# Altium schematic sheet MCU_Control.SchDoc
size A4; SheetNumber: 5; SheetTotal: 5
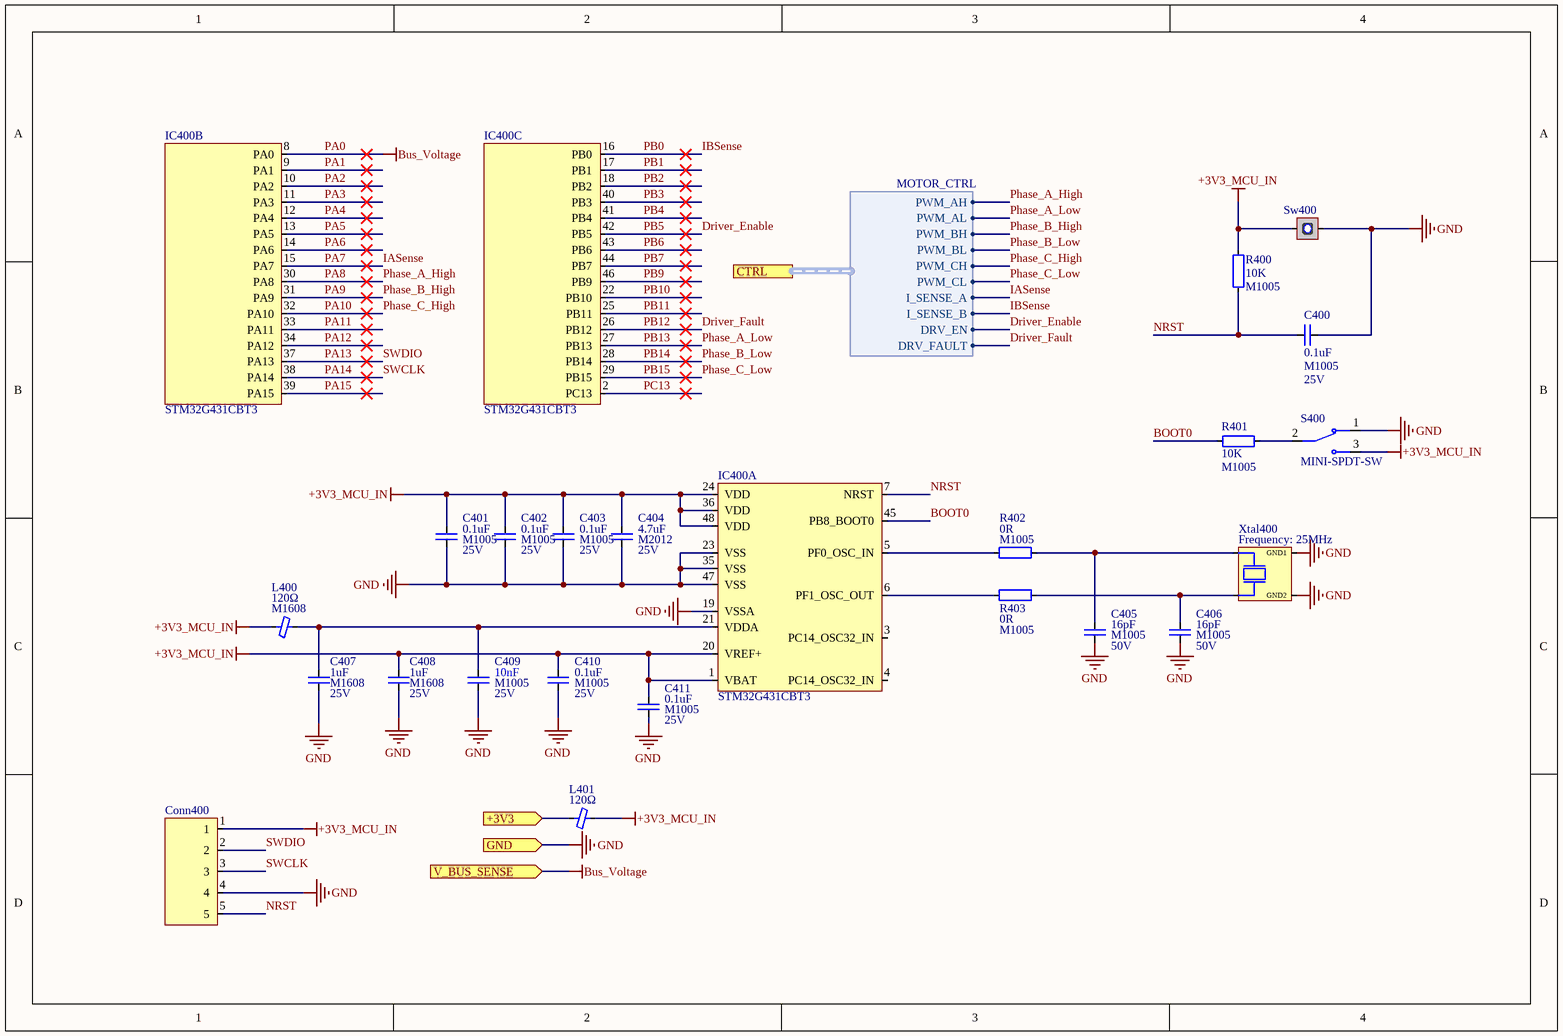
[diagram p0: MCU_Control.SchDoc]

## Parts
C400  value 0.1uF  Package: M1005  Rated Voltage: 25V  [Capacitor_Seramic_M1005_I0402]  (hidden comment: Capacitor_Seramic)
C401  value 0.1uF  Package: M1005  Rated Voltage: 25V  [Capacitor_Seramic_M1005_I0402]  (hidden comment: Capacitor_Seramic)
C402  value 0.1uF  Package: M1005  Rated Voltage: 25V  [Capacitor_Seramic_M1005_I0402]  (hidden comment: Capacitor_Seramic)
C403  value 0.1uF  Package: M1005  Rated Voltage: 25V  [Capacitor_Seramic_M1005_I0402]  (hidden comment: Capacitor_Seramic)
C404  value 4.7uF  Package: M2012  Rated Voltage: 25V  [Capacitor_Seramic_M2012_I0805]  (hidden comment: Capacitor_Seramic)
C405  value 16pF  Package: M1005  Rated Voltage: 50V  [Capacitor_Seramic_M1005_I0402]  (hidden comment: Capacitor_Seramic)
C406  value 16pF  Package: M1005  Rated Voltage: 50V  [Capacitor_Seramic_M1005_I0402]  (hidden comment: Capacitor_Seramic)
C407  value 1uF  Package: M1608  Rated Voltage: 25V  [Capacitor_Seramic_M1608_I0603]  (hidden comment: Capacitor_Seramic)
C408  value 1uF  Package: M1608  Rated Voltage: 25V  [Capacitor_Seramic_M1608_I0603]  (hidden comment: Capacitor_Seramic)
C409  value 10nF  Package: M1005  Rated Voltage: 25V  [Capacitor_Seramic_M1005_I0402]  (hidden comment: Capacitor_Seramic)
C410  value 0.1uF  Package: M1005  Rated Voltage: 25V  [Capacitor_Seramic_M1005_I0402]  (hidden comment: Capacitor_Seramic)
C411  value 0.1uF  Package: M1005  Rated Voltage: 25V  [Capacitor_Seramic_M1005_I0402]  (hidden comment: Capacitor_Seramic)
Conn400  SM05B-GHS-TB(LF)(SN)  [Connector - JST, SM05B-GHS-TB]  (value not drawn)
IC400  STM32G431CBT3  [QFP-48, 9mm x 9mm x 1.6mm]  (parts A,B,C of 3)
L400  value 120Ω  Package: M1608  [Ferrite_Bead_Smd_M1608_I0603]  (hidden comment: Ferrite Bead)
L401  value 120Ω  [Ferrite_Bead_Smd_M1608_I0603]  (hidden comment: Ferrite Bead)
R400  value 10K  Package: M1005  [Resistor_SMD_M1005_I0402]  (hidden comment: Resistor)
R401  value 10K  Package: M1005  [Resistor_SMD_M1005_I0402]  (hidden comment: Resistor)
R402  value 0R  Package: M1005  [Resistor_SMD_M1005_I0402]  (hidden comment: Resistor)
R403  value 0R  Package: M1005  [Resistor_SMD_M1005_I0402]  (hidden comment: Resistor)
S400  MINI-SPDT-SW  [MINI-SPDT-SW]
Sw400  Tactile, SPST  [Tactile, SPST - Panasonic, EVQQ2]  (value not drawn)
Xtal400  Frequency: 25MHz  [Kyocera, CX3225SB]  (hidden comment: Crystal, Two Gnd Pins)

## Ports
+3V3 (in), CTRL (harness MOTOR_CTRL), GND (in), V_BUS_SENSE (in)

## Harnesses
MOTOR_CTRL: PWM_AH, PWM_AL, PWM_BH, PWM_BL, PWM_CH, PWM_CL, I_SENSE_A, I_SENSE_B, DRV_EN, DRV_FAULT

## Nets
+3V3_MCU_IN: C401.1 C402.1 C403.1 C404.1 C408.1 C410.1 C411.1 Conn400.1 IC400.1(VBAT) IC400.20(VREF+) IC400.24(VDD) IC400.36(VDD) IC400.48(VDD) L400.1 L401.2 R400.1 S400.3 Sw400.B
GND: C400.1 C401.2 C402.2 C403.2 C404.2 C405.2 C406.2 C407.2 C408.2 C409.2 C410.2 C411.2 Conn400.4 IC400.19(VSSA) IC400.23(VSS) IC400.35(VSS) IC400.47(VSS) S400.1 Sw400.A Xtal400.GND1 Xtal400.GND2 ; port GND
PA0: IC400.8(PA0) ; port V_BUS_SENSE  [also labelled Bus_Voltage]
+3V3: L401.1 ; port +3V3
BOOT0: IC400.45(PB8_BOOT0) R401.2
Driver_Enable: IC400.42(PB5) ; port CTRL.DRV_EN  [also labelled PB5]
Driver_Fault: IC400.26(PB12) ; port CTRL.DRV_FAULT  [also labelled PB12]
IASense: IC400.15(PA7) ; port CTRL.I_SENSE_A  [also labelled PA7]
IBSense: IC400.16(PB0) ; port CTRL.I_SENSE_B  [also labelled PB0]
NRST: C400.2 Conn400.5 IC400.7(NRST) R400.2
PA1: IC400.9(PA1)
PA2: IC400.10(PA2)
PA3: IC400.11(PA3)
PA4: IC400.12(PA4)
PA5: IC400.13(PA5)
PA6: IC400.14(PA6)
PA8: IC400.30(PA8) ; port CTRL.PWM_AH  [also labelled Phase_A_High]
PA9: IC400.31(PA9) ; port CTRL.PWM_BH  [also labelled Phase_B_High]
PA10: IC400.32(PA10) ; port CTRL.PWM_CH  [also labelled Phase_C_High]
PA11: IC400.33(PA11)
PA12: IC400.34(PA12)
PA13: Conn400.2 IC400.37(PA13)  [also labelled SWDIO]
PA14: Conn400.3 IC400.38(PA14)  [also labelled SWCLK]
PA15: IC400.39(PA15)
PB1: IC400.17(PB1)
PB2: IC400.18(PB2)
PB3: IC400.40(PB3)
PB4: IC400.41(PB4)
PB6: IC400.43(PB6)
PB7: IC400.44(PB7)
PB9: IC400.46(PB9)
PB10: IC400.22(PB10)
PB11: IC400.25(PB11)
PB13: IC400.27(PB13) ; port CTRL.PWM_AL  [also labelled Phase_A_Low]
PB14: IC400.28(PB14) ; port CTRL.PWM_BL  [also labelled Phase_B_Low]
PB15: IC400.29(PB15) ; port CTRL.PWM_CL  [also labelled Phase_C_Low]
PC13: IC400.2(PC13)
NetC405_1: C405.1 R402.2 Xtal400.2
NetC406_1: C406.1 R403.2 Xtal400.1
NetC407_1: C407.1 C409.1 IC400.21(VDDA) L400.2
NetIC400_5: IC400.5(PF0_OSC_IN) R402.1
NetIC400_6: IC400.6(PF1_OSC_OUT) R403.1
NetR401_1: R401.1 S400.2

Not connected (* = marked no-connect by the designer): IC400 3(PC14_OSC32_IN) 4(PC14_OSC32_IN)

## Library data of the parts
C400-C403 C410 C411 = Capacitor_Seramic: Cap, Cer, 0.1uF, 25V, M1005; Manufacturer Part Number: CC0402KRX7R8BB104; Manufacturer: YAGEO; Tolerance: ±10%; Temperature Coefficient: X7R; ComponentLink1Description: Datasheet; ComponentLink1URL: *; ComponentLink2Description: Supplier Link; ComponentLink2URL: https://www.digikey.com/en/products/detail/yageo/CC0402KRX7R8BB104/5698946; Supplier Part Number: 311-2077-1-ND; Supplier Link: https://www.digikey.com/en/products/detail/yageo/CC0402KRX7R8BB104/5698946; Supplier Currency: $; Supplier: Digikey; Quantity, Min: 1; Quantity, Max: 1,000; Price, Min: $0.10000; Price, Max: $0.00700; Operating Temperature, Min: -55℃; Operating Temperature, Max: +125℃; Component Type: Ceramic; Component Category: Capacitor
C404 = Capacitor_Seramic: Cap, Cer, 4.7uF, 25V, M2012; Manufacturer Part Number: C2012X7R1E475K125AB; Manufacturer: TDK Corporation; Tolerance: ±10%; Temperature Coefficient: X7R; ComponentLink1Description: Datasheet; ComponentLink1URL: *; ComponentLink2Description: Supplier Link; ComponentLink2URL: https://www.digikey.com/en/products/detail/tdk-corporation/C2012X7R1E475K125AB/2443450; Supplier Part Number: 445-5972-1-ND; Supplier Link: https://www.digikey.com/en/products/detail/tdk-corporation/C2012X7R1E475K125AB/2443450; Supplier Currency: $; Supplier: Digikey; Quantity, Min: 1; Quantity, Max: 1,000; Price, Min: $0.08389; Price, Max: $0.31000; Operating Temperature, Min: -55℃; Operating Temperature, Max: +125℃; Component Type: Ceramic; Component Category: Capacitor
C405 C406 = Capacitor_Seramic: Cap, Cer, 16pF, 50V, M1005; Manufacturer Part Number: 0402N160J500CT; Manufacturer: Walsin; Tolerance: 5%; Temperature Coefficient: C0G, NP0; ComponentLink1Description: Datasheet; ComponentLink1URL: C:\Users\Public\Documents\Altium\env\Datasheets\Capacitor\Walsin - Multilayer Ceramic Capacitors.pdf; ComponentLink2Description: Supplier Link; ComponentLink2URL: https://www.digikey.com/en/products/detail/walsin-technology-corporation/0402N160J500CT/9354759; Supplier Part Number: 1292-1262-1-ND; Supplier Link: https://www.digikey.com/en/products/detail/walsin-technology-corporation/0402N160J500CT/9354759; Supplier Currency: $; Supplier: Digikey; Quantity, Min: 1; Quantity, Max: 250,000; Price, Min: $0.10000; Price, Max: $0.00182; Operating Temperature, Min: -55℃; Operating Temperature, Max: +125℃; Component Type: Ceramic; Component Category: Capacitor
C407 C408 = Capacitor_Seramic: Cap, Cer, 1uF, 25V, M1608; Manufacturer Part Number: C1608X7R1E105K080AB; Manufacturer: TDK Corporation; Tolerance: ±10%; Temperature Coefficient: X7R; ComponentLink1Description: Datasheet; ComponentLink1URL: *; ComponentLink2Description: Supplier Link; ComponentLink2URL: https://www.digikey.com/en/products/detail/tdk-corporation/C1608X7R1E105K080AB/2443434; Supplier Part Number: 445-5956-1-ND; Supplier Link: https://www.digikey.com/en/products/detail/tdk-corporation/C1608X7R1E105K080AB/2443434; Supplier Currency: $; Supplier: Digikey; Quantity, Min: 1; Quantity, Max: 1,000; Price, Min: $0.17000; Price, Max: $0.04094; Operating Temperature, Min: -55℃; Operating Temperature, Max: +125℃; Component Type: Ceramic; Component Category: Capacitor
C409 = Capacitor_Seramic: Cap, Cer, 10nF, 25V, M1005; Manufacturer Part Number: CC0402KRX7R8BB103; Manufacturer: Yageo; Tolerance: ±10%; Temperature Coefficient: X7R; ComponentLink1Description: Datasheet; ComponentLink1URL: *; ComponentLink2Description: Supplier Link; ComponentLink2URL: https://www.digikey.com/en/products/detail/yageo/CC0402KRX7R8BB103/2103075?gclsrc=aw.ds&gad_source=1&gad_campaignid=23391254850&gclid=CjwKCAiAtq_NBhA_EiwA78nNWGKQIuoNpaDjFR0x6uIZ4lP-9pxxjupUYthtdvwysINaw3uno6RNTxoCiyoQAvD_BwE; Supplier Part Number: 311-1337-1-ND; Supplier Link: https://www.digikey.com/en/products/detail/yageo/CC0402KRX7R8BB103/2103075?gclsrc=aw.ds&gad_source=1&gad_campaignid=23391254850&gclid=CjwKCAiAtq_NBhA_EiwA78nNWGKQIuoNpaDjFR0x6uIZ4lP-9pxxjupUYthtdvwysINaw3uno6RNTxoCiyoQAvD_BwE; Supplier Currency: $; Supplier: Digikey; Quantity, Min: 1; Quantity, Max: 5,000; Price, Min: $0.10000; Price, Max: $0.00455; Operating Temperature, Min: -55℃; Operating Temperature, Max: +125℃; Component Type: Ceramic; Component Category: Capacitor
Conn400 = Connector - 5P: Description; Manufacturer: JST Sales America Inc.; ComponentLink1Description: Supplier Link; ComponentLink1URL: https://www.digikey.com/en/products/detail/jst-sales-america-inc/SM05B-GHS-TB/807789; Supplier Part Number: 455-SM05B-GHS-TBCT-ND; Supplier: Digikey; Operating Temperature, Min: -25℃; Operating Temperature, Max: +85℃; Quantity, Min: 1; Quantity, Max: 1,000; Price, Min: $0.40000; Supplier Currency: $; Price, Max: $0.24489; Supplier Link: https://www.digikey.com/en/products/detail/jst-sales-america-inc/SM05B-GHS-TB/807789; Component Type: Header; Component Category: Connector; Package: 5Pin; Manufacturer Part Number: SM05B-GHS-TB
IC400 = STM32G431CBT3: Mainstream Arm Cortex-M4 MCU 170 MHz with 128 Kbytes of Flash memory, Math Accelerator, Medium Analog level integration; Manufacturer_Name: STMicroelectronics; Geometry.Height: 1.6mm; Manufacturer_Part_Number: STM32G431CBT3; Datasheet Link: https://www.st.com/resource/en/datasheet/stm32g431c6.pdf
L400 L401 = Ferrite Bead: Manufacturer Part Number: BLM18PG121SN1D; Manufacturer: Murata Electronics; Component Category: Inductor; ComponentLink1Description: Datasheet; ComponentLink1URL: *; ComponentLink2Description: Supplier Link; ComponentLink2URL: https://www.digikey.com/en/products/detail/murata-electronics/BLM18PG121SN1D/584248; Supplier: Digikey; Supplier Part Number: 490-1037-1-ND; Operating Temperature, Min: -55℃; Operating Temperature, Max: +125℃; Quantity, Min: 1; Quantity, Max: 1,000; Price, Min: $0.10000; Price, Max: $0.02791; Supplier Currency: $; Supplier Link: https://www.digikey.com/en/products/detail/murata-electronics/BLM18PG121SN1D/584248; Component Type: Ferrite Bead
  L401: Package: M1608
R400 R401 = Resistor: Res, 10K, 1%, M1005; Manufacturer: Yageo; Manufacturer Part Number: RC0402FR-0710KP; Supplier: Digikey; Supplier Part Number: YAG1249CT-ND; Operating Temperature, Min: -55℃; Operating Temperature, Max: +155℃; Quantity, Min: 1; Quantity, Max: 250,000; Price, Min: $0.11000; Price, Max: $0.00359; Supplier Currency: $; Supplier Link: https://www.digikey.com/en/products/detail/yageo/RC0402FR-0710KP/4935264; Tolerance: 1%; Component Type: Fixed Value; Component Category: Resistor; ComponentLink1Description: Datasheet; ComponentLink1URL: C:\Users\Public\Documents\Altium\env\Datasheets\Resistor\Yageo - RC_L Series.pdf; ComponentLink2Description: Supplier Link; ComponentLink2URL: https://www.digikey.com/en/products/detail/yageo/RC0402FR-0710KP/4935264
R402 R403 = Resistor: Manufacturer: Yageo; Manufacturer Part Number: RC0402FR-070RL; Supplier: Digikey; Supplier Part Number: 311-0.0LRCT-ND; Operating Temperature, Min: -55℃; Operating Temperature, Max: +155℃; Quantity, Min: 1; Quantity, Max: 250000; Price, Min: $0.10000; Price, Max: $0.00133; Supplier Currency: $; Supplier Link: https://www.digikey.com/en/products/detail/yageo/RC0402FR-070RL/2827570; Tolerance: *; Component Type: Fixed Value; Component Category: Resistor; ComponentLink1Description: Datasheet; ComponentLink1URL: C:\Users\Public\Documents\Altium\env\Datasheets\Resistor\Yageo - RC_L Series.pdf; ComponentLink2Description: Supplier Link; ComponentLink2URL: https://www.digikey.com/en/products/detail/yageo/RC0402FR-070RL/2827570
S400 = MINI-SPDT-SW: Simple breadboard friendly SPDT slide switch. Rated at 30V/200mA with operating force of 250 +/-100gf.; Availability: Unavailable; Package: None; MP: MINI-SPDT-SW; Value: *; Price: None
Sw400 = Tactile, SPST: Switch, Tactile, SPST, SMD; Manufacturer: Panasonic; Manufacturer Part Number: EVQ-Q2K03W; ComponentLink1Description: Datasheet; ComponentLink1URL: C:\Users\Public\Documents\Altium\env\Datasheets\Switch\Tactile, SPST - Panasonic, EVQP0, EVQQ2, EVQ6Q2, EVQ7Q2, EVPBT Series.pdf; ComponentLink2Description: Supplier Link; ComponentLink2URL: https://www.digikey.com/en/products/detail/panasonic-electronic-components/EVQ-Q2K03W/762893; Supplier: Digikey; Supplier Part Number: P12943SCT-ND; Operating Temperature, Min: -40℃; Operating Temperature, Max: +85℃; Quantity, Min: 1; Quantity, Max: 50,000; Price, Min: $0.29000; Supplier Currency: $; Price, Max: $0.13296; Supplier Link: https://www.digikey.com/en/products/detail/panasonic-electronic-components/EVQ-Q2K03W/762893; Component Type: Tactile; Component Category: Switch; Package: SMD
Xtal400 = Crystal, Two Gnd Pins: XTAL, 25MHz, 12pF; Manufacturer: Kyocera; Manufacturer Part Number: CX3225SB25000H0FLJCC; ComponentLink1Description: Datasheet; ComponentLink1URL: C:\Users\Public\Documents\Altium\env\Datasheets\Crystal\Kyocera, CX3225SB.pdf; ComponentLink2Description: Supplier Link; ComponentLink2URL: https://www.digikey.com/en/products/detail/kyocera-avx/cx3225sb25000h0fljcc/6123312; Supplier: Digikey; Supplier Part Number: 478-CX3225SB25000H0FLJCCCT-ND; Operating Temperature, Min: -30℃; Operating Temperature, Max: +85℃; Quantity, Min: 1; Quantity, Max: 21,000; Price, Min: $0.66000; Supplier Currency: $; Price, Max: $0.36682; Supplier Link: https://www.digikey.com/en/products/detail/kyocera-avx/cx3225sb25000h0fljcc/6123312; Component Type: Crystal; Component Category: Crystal; Package: SMD